# EAGLE design Gen4Board (EAGLE 9.4.2)
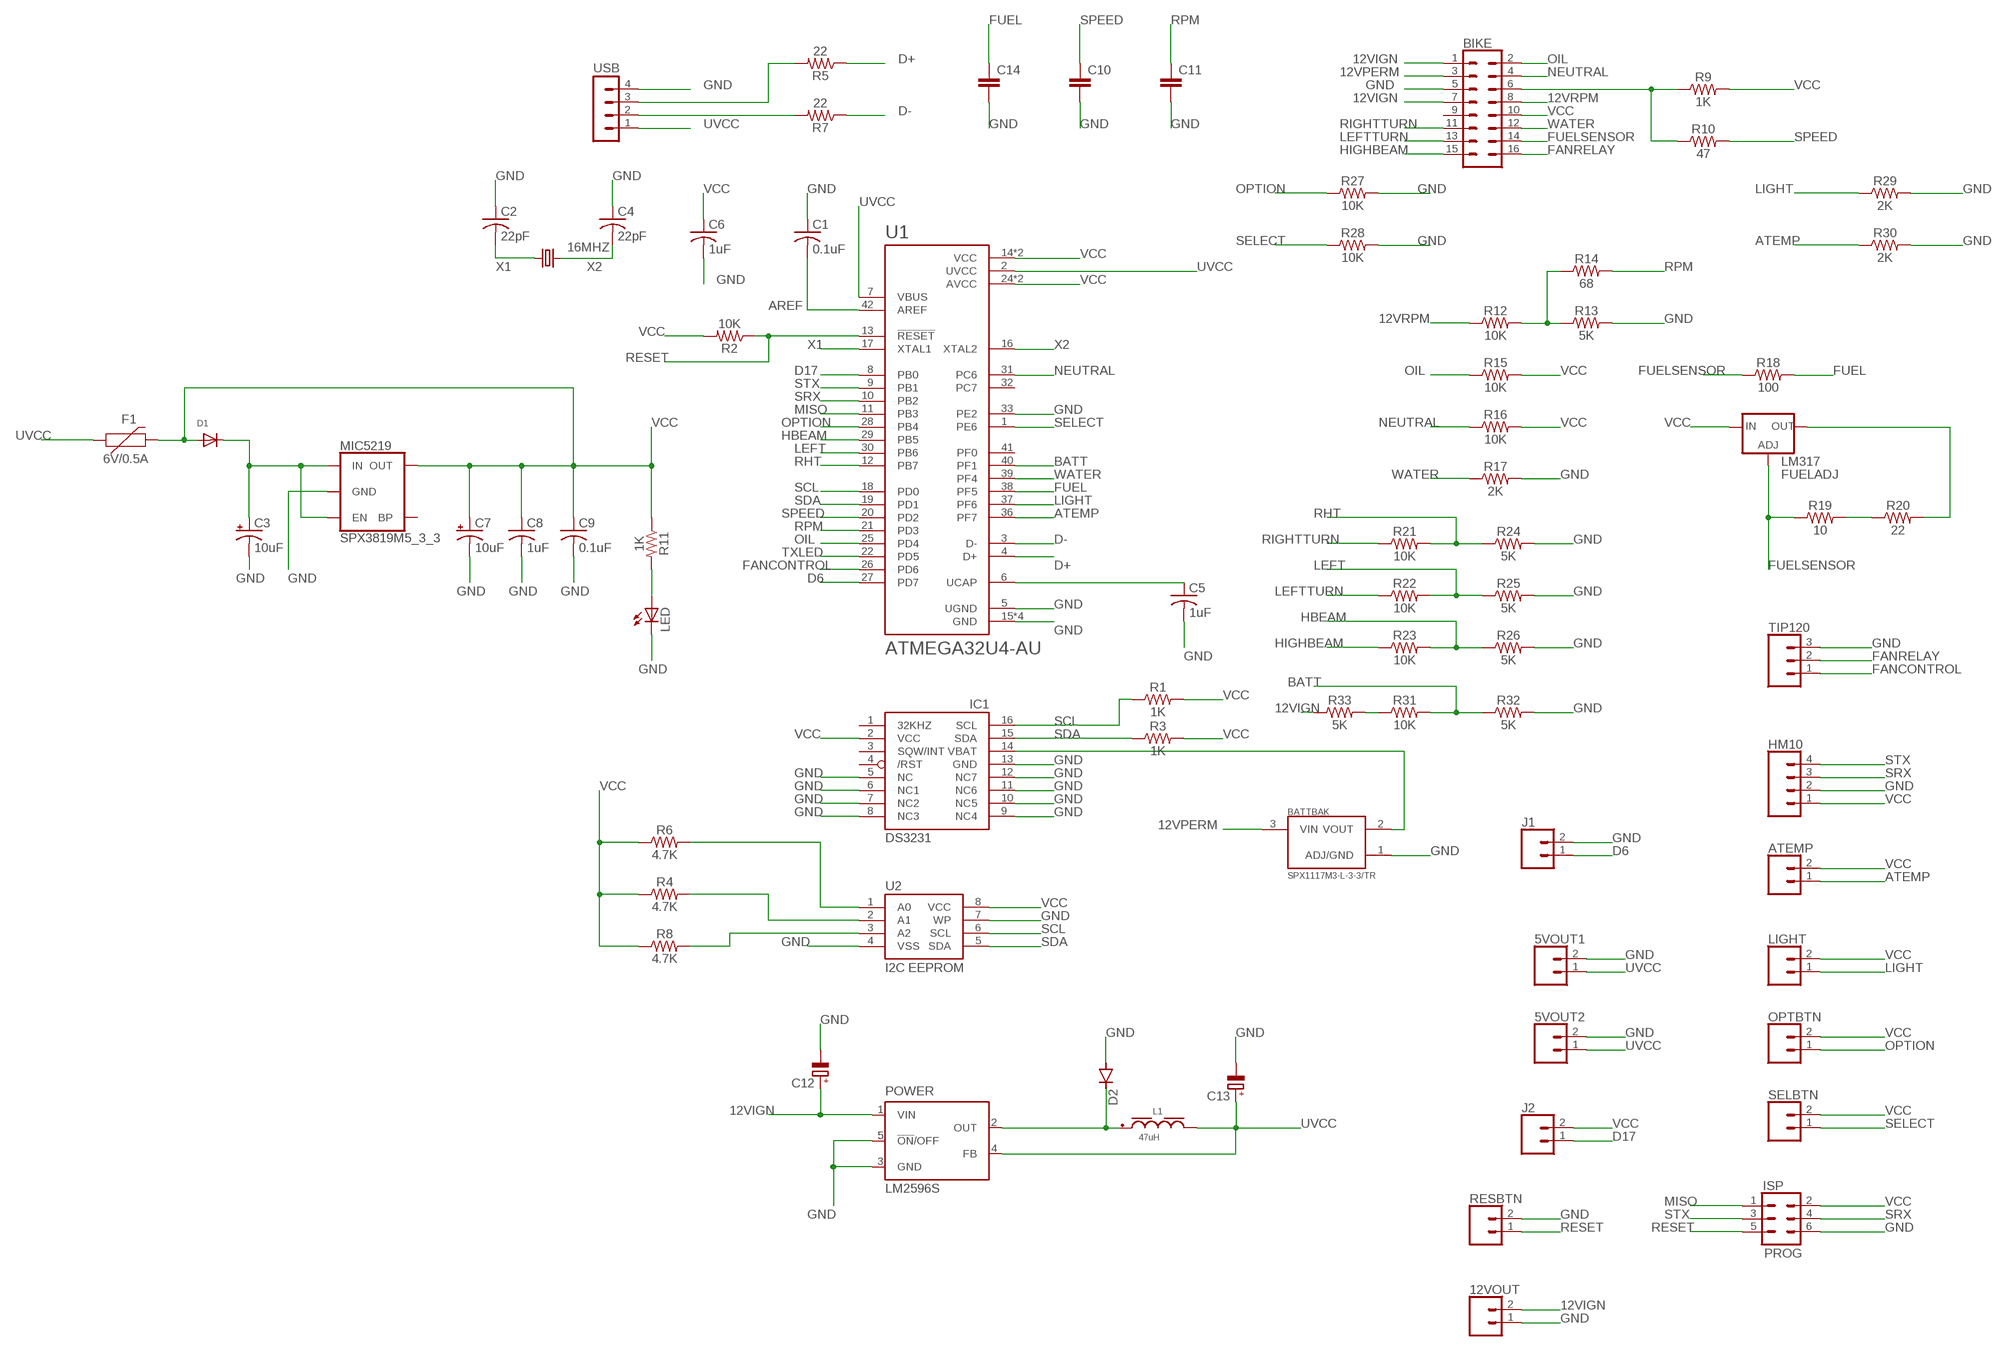
[diagram p0: schematic, sheet 1]

## Parts
5VOUT1  CONN_02  [1X02]
5VOUT2  CONN_02  [1X02]
12VOUT  CONN_02  [1X02]
16MHZ  KX-9A  [5.0X3.2_KX-9A]
ATEMP  CONN_02  [1X02]
BATTBAK  SPX1117M3-L-3-3/TR  [SOT230P700X180-3N]
BIKE  CONN_08X2  [2X8]
C1  0.1uF  C-USC0603  [C0603]
C2  22pF  C-USC0603  [C0603]
C3  10uF  10UF-POLAR-EIA3216-16V-10%(TANT)  [EIA3216]
C4  22pF  C-USC0603  [C0603]
C5  1uF  C-USC0603  [C0603]
C6  1uF  C-USC0603  [C0603]
C7  10uF  10UF-POLAR-EIA3216-16V-10%(TANT)  [EIA3216]
C8  1uF  C-USC0603  [C0603]
C9  0.1uF  C-USC0603  [C0603]
C10  C2,5-3  [C2.5-3]
C11  C2,5-3  [C2.5-3]
C12  CPOL-EUTT5D10  [TT5D10]
C13  CPOL-EUTT5D10  [TT5D10]
C14  C2,5-3  [C2.5-3]
D1  DIODESOD-323F  [SOD-323F]
D2  DIODE-DO214AC  [DO214AC]
F1  6V/0.5A  PPTC_HALF-AMP  [1206]
HM10  CONN_04  [1X04]
IC1  DS3231/SO  [SO16W]
ISP  PROG  CONN_03X2FEMALE  [2X3]
J1  CONN_02  [1X02]
J2  CONN_02  [1X02]
L1  47uH  WE-PD_1260_74477126  [WE-PD_1260]
LED  LEDCHIPLED_0603  [CHIPLED_0603]
LIGHT  CONN_02  [1X02]
LM317  FUELADJ  V_REG_317SINK  [TO220-ADJ]
MIC5219  SPX3819M5_3_3  V_REG_SPX3819-SOT23-5  [SOT23-5]
OPTBTN  CONN_02  [1X02]
POWER  LM2596S  [TO263-5]
R1  1K  2.0KOHM-0603-1/10W-5%  [0603]
R2  10K  2.0KOHM-0603-1/10W-5%  [0603]
R3  1K  2.0KOHM-0603-1/10W-5%  [0603]
R4  4.7K  2.0KOHM-0603-1/10W-5%  [0603]
R5  22  2.0KOHM-0603-1/10W-5%  [0603]
R6  4.7K  2.0KOHM-0603-1/10W-5%  [0603]
R7  22  2.0KOHM-0603-1/10W-5%  [0603]
R8  4.7K  2.0KOHM-0603-1/10W-5%  [0603]
R9  1K  RESISTOR1206  [1206]
R10  47  RESISTOR1206  [1206]
R11  1K  2.0KOHM-0603-1/10W-5%  [0603]
R12  10K  RESISTOR1206  [1206]
R13  5K  RESISTOR1206  [1206]
R14  68  RESISTOR1206  [1206]
R15  10K  RESISTOR1206  [1206]
R16  10K  RESISTOR1206  [1206]
R17  2K  RESISTOR1206  [1206]
R18  100  RESISTOR1206  [1206]
R19  10  RESISTOR1206  [1206]
R20  22  RESISTOR1206  [1206]
R21  10K  RESISTOR1206  [1206]
R22  10K  RESISTOR1206  [1206]
R23  10K  RESISTOR1206  [1206]
R24  5K  RESISTOR1206  [1206]
R25  5K  RESISTOR1206  [1206]
R26  5K  RESISTOR1206  [1206]
R27  10K  RESISTOR1206  [1206]
R28  10K  RESISTOR1206  [1206]
R29  2K  RESISTOR1206  [1206]
R30  2K  RESISTOR1206  [1206]
R31  10K  RESISTOR1206  [1206]
R32  5K  RESISTOR1206  [1206]
R33  5K  RESISTOR1206  [1206]
RESBTN  CONN_02  [1X02]
SELBTN  CONN_02  [1X02]
TIP120  CONN_03  [1X03]
U1  ATMEGA32U4-AU  [QFP80P1200X1200X120-44N]
U2  I2C EEPROM  EEPROM-I2CEIAJ  [SO08-EIAJ]
USB  MA04-1  [MA04-1]

## Nets
12VIGN: 12VOUT.2 BIKE.1 BIKE.7 C12.+ POWER.1(VIN) R33.1
12VPERM: BATTBAK.3(VIN) BIKE.3
12VRPM: BIKE.8 R12.1
AREF: C1.2 U1.42(AREF)
ATEMP: ATEMP.1 R30.1 U1.36(PF7)
BATT: R31.2 R32.1 U1.40(PF1)
D6: J1.1 U1.27(PD7)
D17: J2.1 U1.8(PB0)
D+: R5.1 U1.4(D+)
D-: R7.1 U1.3(D-)
FANCONTROL: TIP120.1 U1.26(PD6)
FANRELAY: BIKE.16 TIP120.2
FUEL: C14.1 R18.2 U1.38(PF5)
FUELSENSOR: BIKE.14 LM317.ADJ R18.1 R19.1
GND: 5VOUT1.2 5VOUT2.2 12VOUT.1 BATTBAK.1(ADJ/GND) BIKE.5 C1.1 C2.1 C3.- C4.1 C5.2 C6.2 C7.- C8.2 C9.2 C10.2 C11.2 C12.- C13.- C14.2 D2.A HM10.2 IC1.5(NC) IC1.6(NC1) IC1.7(NC2) IC1.8(NC3) IC1.9(NC4) IC1.10(NC5) IC1.11(NC6) IC1.12(NC7) IC1.13(GND) ISP.6 J1.2 LED.C MIC5219.2(GND) POWER.3(GND) POWER.5(!ON!/OFF) R13.2 R17.2 R24.2 R25.2 R26.2 R27.2 R28.2 R29.2 R30.2 R32.2 RESBTN.2 TIP120.3 U1.5(UGND) U1.15(GND) U1.23(GND) U1.33(PE2) U1.35(GND) U1.43(GND) U2.4(VSS) U2.7(WP) USB.4
HBEAM: R23.2 R26.1 U1.29(PB5)
HIGHBEAM: BIKE.15 R23.1
LEFT: R22.2 R25.1 U1.30(PB6)
LEFTTURN: BIKE.13 R22.1
LIGHT: LIGHT.1 R29.1 U1.37(PF6)
MISO: ISP.1 U1.11(PB3)
N$2: R7.2 USB.2
N$3: R5.2 USB.3
N$4: C5.1 U1.6(UCAP)
N$5: LED.A R11.2
N$6: C3.+ D1.C MIC5219.1(IN) MIC5219.3(EN)
N$7: R6.2 U2.1(A0)
N$8: R4.2 U2.2(A1)
N$9: BATTBAK.2(VOUT) IC1.14(VBAT)
N$10: R8.2 U2.3(A2)
N$11: BIKE.6 R9.1 R10.1
N$12: LM317.OUT R20.2
N$13: R12.2 R13.1 R14.1
N$14: D2.C L1.1 POWER.2(OUT)
N$15: R19.2 R20.1
N$16: R31.1 R33.2
NEUTRAL: BIKE.4 R16.1 U1.31(PC6)
OIL: BIKE.2 R15.1 U1.25(PD4)
OPTION: OPTBTN.1 R27.1 U1.28(PB4)
RESET: ISP.5 R2.1 RESBTN.1 U1.13(!RESET)
RHT: R21.2 R24.1 U1.12(PB7)
RIGHTTURN: BIKE.11 R21.1
RPM: C11.1 R14.2 U1.21(PD3)
SCL: IC1.16(SCL) R1.1 U1.18(PD0) U2.6(SCL)
SDA: IC1.15(SDA) R3.1 U1.19(PD1) U2.5(SDA)
SELECT: R28.1 SELBTN.1 U1.1(PE6)
SPEED: C10.1 R10.2 U1.20(PD2)
SRX: HM10.3 ISP.4 U1.10(PB2)
STX: HM10.4 ISP.3 U1.9(PB1)
TXLED: U1.22(PD5)
UVCC: 5VOUT1.1 5VOUT2.1 C13.+ F1.1 L1.2 POWER.4(FB) U1.2(UVCC) U1.7(VBUS) USB.1
VCC: ATEMP.2 BIKE.10 C6.1 C7.+ C8.1 C9.1 D1.A F1.2 HM10.1 IC1.2(VCC) ISP.2 J2.2 LIGHT.2 LM317.IN MIC5219.5(OUT) OPTBTN.2 R1.2 R2.2 R3.2 R4.1 R6.1 R8.1 R9.2 R11.1 R15.2 R16.2 SELBTN.2 U1.14(VCC) U1.24(AVCC) U1.34(VCC) U1.44(AVCC) U2.8(VCC)
WATER: BIKE.12 R17.1 U1.39(PF4)
X1: 16MHZ.1 C2.2 U1.17(XTAL1)
X2: 16MHZ.3 C4.2 U1.16(XTAL2)
Unconnected: BIKE.9 IC1.1(32KHZ) IC1.3(SQW/INT) IC1.4(/RST) MIC5219.4(BP) U1.32(PC7) U1.41(PF0)

## Library data of the parts
5VOUT1 5VOUT2 12VOUT ATEMP J1 J2 LIGHT OPTBTN RESBTN SELBTN = SparkFun-Connectors:CONN_02: Multi connection point. Often used as Generic Header-pin footprint for 0.1 inch spaced/style header connections On any of the 0.1 inch spaced packages, you can populate with these: Break Away Headers - Straight <https://www.sparkfun.com/products/116> (PRT-00116) Break Away Male Headers - Right Angle <https://www.sparkfun.com/products/553> (PRT-00553) Female Headers <https://www.sparkfun.com/products/115> (PRT-00115) Break Away Headers - Machine Pin <https://www.sparkfun.com/products/117> (PRT-00117) Break Away Female Headers - Swiss Machine Pin <https://www.sparkfun.com/products/743> (PRT-00743) For SCREWTERMINALS and SPRING TERMINALS visit here: Screw Terimnals on SparkFun.com <https://www.sparkfun.com/search/results?term=Screw+Terminals> (5mm/3.5mm/2.54mm spacing) This device is also useful as a general connection point to wire up your design to another part of your project. Our various solder wires solder well into these plated through hole pads. Hook-Up Wire - Assortment (Stranded, 22 AWG) <https://www.sparkfun.com/products/11375> (PRT-11375) Hook-Up Wire - Assortment (Solid Core, 22 AWG) <https://www.sparkfun.com/products/11367> (PRT-11367) View the entire wire category on our website here <https://www.sparkfun.com/categories/141> Special notes: Molex polarized connector foot print use with: PRT-08233 with associated crimp pins and housings. 2.54_SCREWTERM for use with PRT-10571. 3.5mm Screw Terminal footprints for PRT-08084 5mm Screw Terminal footprints for use with PRT-08432
16MHZ = crystal-geyer_V1_0:KX: Quartz Crystals (MHz) SMD: KX - Serie Model Size l/w/h [mm] Frequency Range Frequency Stability Temp. Range [°C] Load Capacitance AECQ 200 availabel Datasheet KX-4 KX-5 KX-6 KX-7 KX-9A KX-9B KX-12A KX-12B KX-13 KX-20 KX-K KX-KS 1.6/1.2/0.3 2.0/1.6/0.45 2.5/2.0/0.55 3.2/2.5/0.8 5.0/3.2/1.0 5.0/3.2/1.1 6.0/3.5/1.1 6.0/3.5/1.0 7.0/5.0 /1.3 11.6/5.5/1.6 12.3/4.5/4.2 12.3/4.5/3.2 24.0 ~ 80.0 MHz 16.0 ~ 80.0 MHz 12.0 ~ 80.0 MHz 8.0 ~ 60.0 MHz 7,68 ~ 300,0 MHz 8,0 ~ 50,0 MHz 8,0 ~ 150,0 MHz 8,0 ~ 50,0 MHz 6,0 ~ 160,0 MHz 3,579 ~ 25,0 MHz 3,579 ~ 70,0 MHz 3,579 ~ 70,0 MHz ±10 … ±50ppm ±10 … ±50ppm ±10 … ±50ppm ±10 … ±50ppm ±10 … ±50ppm ±10 … ±50ppm ±10 … ±50ppm ±10 … ±50ppm ±10 … ±50ppm ±50ppm ±10 … ±50ppm ±10 … ±50ppm (*) -40°C …+85°C (*) -40°C …+125°C (*) -40°C …+125°C (*) -40°C …+125°C (*) -40°C …+105°C (*) -40°C …+105°C (*) -40°C …+125°C (*) -40°C …+105°C (*) -40°C …+105°C (*) -40°C …+105°C (*) -40°C …+85°C (*) -40°C …+85°C 8, 8…16 8, 8…16 10, 8…16 12, 7…20 16, 10…20 16, 10…20 16, 10…20 16, 12…20 16, 12…20 16, 12…20 16, 12…30 16, 12…30 - yes yes yes - - - - - - - - KX-4.pdf <http://www.geyer-electronic.de/uploads/tx_userartikelfrequenz/GEYER-KX-4.pdf> KX-5.pdf <http://www.geyer-electronic.de/uploads/tx_userartikelfrequenz/GEYER-KX-5.pdf> KX-6.pdf <http://www.geyer-electronic.de/uploads/tx_userartikelfrequenz/GEYER-KX-6.pdf> KX-7.pdf <http://www.geyer-electronic.de/uploads/tx_userartikelfrequenz/GEYER-KX-7.pdf> KX-9A.pdf <http://www.geyer-electronic.de/uploads/tx_userartikelfrequenz/GEYER-KX-9A.pdf> KX-9B.pdf <http://www.geyer-electronic.de/uploads/tx_userartikelfrequenz/GEYER-KX-9B.pdf> KX-12A.pdf <http://www.geyer-electronic.de/uploads/tx_userartikelfrequenz/GEYER-KX-12A.pdf> KX-12B.pdf <http://www.geyer-electronic.de/uploads/tx_userartikelfrequenz/GEYER-KX-12B.pdf> KX-13.pdf <http://www.geyer-electronic.de/uploads/tx_userartikelfrequenz/GEYER-KX-13.pdf> KX-20.pdf <http://www.geyer-electronic.de/uploads/tx_userartikelfrequenz/GEYER-KX-20.pdf> KX-K.pdf <http://www.geyer-electronic.de/uploads/tx_userartikelfrequenz/GEYER-KX-K.pdf> KX-KS.pdf <http://www.geyer-electronic.de/uploads/tx_userartikelfrequenz/GEYER-KX-KS.pdf> <http://www.geyer-electronic.de/fileadmin/template/img/logo-geyer-electronic.png> Details see: http://www.geyer-electronic.de/Frequenz-Produkte.9.0.html Created 2016-06-07, Hans Locher 2016 (C) Geyer Quartz Technology KX4,KX5,KX6,KX7,KX9A,KX9B,KX12A,KX12B,KX13,KX20,KXK,KXKS;1612;2016;2520;3225;5032;6035;7050;11655;12345;1,6x1,2;2,0x1,6;2,5x2,0;3,2x2,5;5,0x3,2;6,0x3,5;7,0x5,0;11,6x5,5;12,3x4,5;12,3x4,5;1.6x1.2;2.0x1.6;2.5x2.0;3.2x2.5;5.0x3.2;6.0x3.5;7.0x5.0;11.6x5.5;12.3x4.5;12.3x4.5;
BATTBAK = SPX1117M3-L-3-3_TR:SPX1117M3-L-3-3/TR: Check prices <https://pricing.snapeda.com/parts/SPX1117M3-L-3-3/TR/MaxLinear%2C%20Inc./view-part?ref=eda>; AVAILABILITY: Good; DESCRIPTION: Linear Voltage Regulator IC Positive Fixed 1 Output 800mA SOT-223; MF: MaxLinear, Inc.; MP: SPX1117M3-L-3-3/TR; PACKAGE: SOT-223 MaxLinear, Inc.; PRICE: None; PURCHASE-URL: https://pricing.snapeda.com/search/part/SPX1117M3-L-3-3/TR/?ref=eda
BIKE = SparkFun-Connectors:CONN_08X2: Multi connection point. Often used as Generic Header-pin footprint for 0.1 inch spaced/style header connections You can populate with any combo of single row headers, but if you'd like an exact match, check this: Header - 2x8 (Male, 0.1") <https://www.sparkfun.com/products/13156> (PRT-13156) On any of the 0.1 inch spaced packages, you can populate with these: Break Away Headers - Straight <https://www.sparkfun.com/products/116> (PRT-00116) Break Away Male Headers - Right Angle <https://www.sparkfun.com/products/553> (PRT-00553) Female Headers <https://www.sparkfun.com/products/115> (PRT-00115) Break Away Headers - Machine Pin <https://www.sparkfun.com/products/117> (PRT-00117) Break Away Female Headers - Swiss Machine Pin <https://www.sparkfun.com/products/743> (PRT-00743)
C1 C2 C4-C6 C8 C9 = adafruit:C-US: CAPACITOR, American symbol
C3 C7 = SparkFun-Capacitors:10UF-POLAR: 10.0µF polarized capacitors A capacitor is a passive two-terminal electrical component used to store electrical energy temporarily in an electric field.; PROD_ID: CAP-00811
C10 C11 C14 = capacitor-wima:C: CAPACITOR naming: grid - package width
C12 C13 = rcl:CPOL-EU: POLARIZED CAPACITOR, European symbol; SPICEPREFIX: C
D1 = adafruit:DIODE: Diode SMADIODE - SMA Surface Mount Package 20V 1A Schottky Diode Digikey: 641-1014-6-ND DO-1N4148 - Through Hole Small Current Diode SOD-123 20V 1 A (.5mV Vf) Schottky Diode - Digikey: MBRX120TPMSCT-ND SOD-323 10V 570mA (.38mV Vf, 3ns) Schottky Diode - Digikey: ZLLS410CT-ND SOD-523 30V 30mA Schottky Diode (RB751S-40TE61) - Digikey: RB751S-40TE61CT-ND SOT23-R/W - SOT23 Package (R = Solder Paste/Reflow Ovens, W = Hand-Soldering) BAT54Film 40V 300mA - Digikey: 497-7162-1-ND
D2 = diode:DIODE-: DIODE
F1 = SparkFun-Fuses:PPTC: Resettable Fuse PPTC Resettable Fuse. Really a sort of resistor with a polymeric positive temperature coefficient whose resistance increases dramatically with an increase in temperature. When heated by the power passing through the resistance rises causing the current to be limited, protecting the circuit. This is achieved by the transition of the polymer from a crystalline to an amorphous state where the conductive carbon separates breaking the conductive pathways found in the cool crystalline structure. When a PPTC cools back down it resumes conducting letting the circuit turn back on. SparkFun Products: SparkFun RedBoard - Programmed with Arduino <https://www.sparkfun.com/products/12757> Pro Micro - 5V/16MHz <https://www.sparkfun.com/products/12640> Arduino Pro 328 - 5V/16MHz <https://www.sparkfun.com/products/10915> MP3 Trigger <https://www.sparkfun.com/products/13720>; PROD_ID: RES-08585
HM10 = SparkFun-Connectors:CONN_04: Multi connection point. Often used as Generic Header-pin footprint for 0.1 inch spaced/style header connections On any of the 0.1 inch spaced packages, you can populate with these: Break Away Headers - Straight <https://www.sparkfun.com/products/116> (PRT-00116) Break Away Male Headers - Right Angle <https://www.sparkfun.com/products/553> (PRT-00553) Female Headers <https://www.sparkfun.com/products/115> (PRT-00115) Break Away Headers - Machine Pin <https://www.sparkfun.com/products/117> (PRT-00117) Break Away Female Headers - Swiss Machine Pin <https://www.sparkfun.com/products/743> (PRT-00743) For SCREWTERMINALS and SPRING TERMINALS visit here: Screw Terimnals on SparkFun.com <https://www.sparkfun.com/search/results?term=Screw+Terminals> (5mm/3.5mm/2.54mm spacing) This device is also useful as a general connection point to wire up your design to another part of your project. Our various solder wires solder well into these plated through hole pads. Hook-Up Wire - Assortment (Stranded, 22 AWG) <https://www.sparkfun.com/products/11375> (PRT-11375) Hook-Up Wire - Assortment (Solid Core, 22 AWG) <https://www.sparkfun.com/products/11367> (PRT-11367) View the entire wire category on our website here <https://www.sparkfun.com/categories/141> Special notes: Molex polarized connector foot print use with SKU : PRT-08231 with associated crimp pins and housings. 1MM SMD Version SKU: PRT-10208; PROD_ID: CONN-09696
IC1 = DS3231:DS3231; AVAILABILITY: Unavailable; DESCRIPTION: Real Time Clock (RTC) IC Clock/Calendar I²C, 2-Wire Serial 16-SOIC (0.295, 7.50mm Width); MF: Maxim Integrated; MP: DS3231; PACKAGE: SOIC-16 Maxim Integrated; PRICE: None
ISP = SparkFun-Connectors:CONN_03X2: Multi connection point. Often used as Generic Header-pin footprint for 0.1 inch spaced/style header connections You can populate with any combo of single row headers, but if you'd like an exact match, check these: Header - 2x3 (Male, 0.1") <https://www.sparkfun.com/products/12807> (PRT-12807) Header - 2x3 (Female, 0.1") <https://www.sparkfun.com/products/13010> (PRT-13010) 2x3 Pin Shrouded Header <https://www.sparkfun.com/products/10877> (PRT-10877) On any of the 0.1 inch spaced packages, you can populate with these: Break Away Headers - Straight <https://www.sparkfun.com/products/116> (PRT-00116) Break Away Male Headers - Right Angle <https://www.sparkfun.com/products/553> (PRT-00553) Female Headers <https://www.sparkfun.com/products/115> (PRT-00115) Break Away Headers - Machine Pin <https://www.sparkfun.com/products/117> (PRT-00117) Break Away Female Headers - Swiss Machine Pin <https://www.sparkfun.com/products/743> (PRT-00743) Special note: the shrouded connector mates well with our 3x2 ribbon cables: Ribbon Crimp Connector - 6-pin (2x3, Female) <https://www.sparkfun.com/products/10651> (PRT-10651) Ribbon Cable - 6 wire (15ft) <https://www.sparkfun.com/products/10646> (PRT-10646); PROD_ID: CONN-11566; VALUE: FEMALE 2x3
L1 = Wurth_Power Magnetics_WE-PD:WE-PD_1260: WE-PD SMT Power Inductor Characteristics AECQ 200 Qualified Ultra low RDC and RAC Highest possible saturation current based on Ferrite Suitable for switching frequency up to 10MHz Temperature dependent parameter available on Redexpert Operating Temperature from -40°C to +125°C / +150°C Types WE-PD: Since always with low loss material, tight tolerances and high saturation behavior compared to other manufacturers in the market WE-PD Robust: Plastic base improves the mechanical stability and efficiency WE-PD Performance: MnZn core improves Saturation and RDC for highest efficiency Applications Switch Mode Power supplies from 0,1W up to 300W Integrated DC DC Converter Ideal for Switch Mode Power supplies with extreme high efficiency (>95%) <https://www.we-online.com/catalog/media/o14825v209%20Family_WE-PD.jpg> Details see: https://www.we-online.com/catalog/en/WE-PD/ Updated by Yingchun,Shan 2019-07-25 2019 (C) Wurth Elektronik; DATASHEET-URL: https://www.we-online.com/catalog/datasheet/74477126.pdf; FRES: 2.3MHz; IR: 0.55A; ISAT: 0.68A; MOUNT: SMT; PART-NUMBER: 74477126; RDC-MAX: 1200mOhm; RDC-TYP: 880mOhm; VALUE: 680uH; VERSION: Standard
LED = adafruit:LED: LED OSRAM: - CHIPLED LG R971, LG N971, LY N971, LG Q971, LY Q971, LO R971, LY R971 LH N974, LH R974 LS Q976, LO Q976, LY Q976 LO Q996 - Hyper CHIPLED LW Q18S LB Q993, LB Q99A, LB R99A - SideLED LS A670, LO A670, LY A670, LG A670, LP A670 LB A673, LV A673, LT A673, LW A673 LH A674 LY A675 LS A676, LA A676, LO A676, LY A676, LW A676 LS A679, LY A679, LG A679 - Hyper Micro SIDELED® LS Y876, LA Y876, LO Y876, LY Y876 LT Y87S - SmartLED LW L88C, LW L88S LB L89C, LB L89S, LG L890 LS L89K, LO L89K, LY L89K LS L896, LA L896, LO L896, LY L896 - TOPLED LS T670, LO T670, LY T670, LG T670, LP T670 LSG T670, LSP T670, LSY T670, LOP T670, LYG T670 LG T671, LOG T671, LSG T671 LB T673, LV T673, LT T673, LW T673 LH T674 LS T676, LA T676, LO T676, LY T676, LB T676, LH T676, LSB T676, LW T676 LB T67C, LV T67C, LT T67C, LS T67K, LO T67K, LY T67K, LW E67C LS E67B, LA E67B, LO E67B, LY E67B, LB E67C, LV E67C, LT E67C LW T67C LS T679, LY T679, LG T679 LS T770, LO T770, LY T770, LG T770, LP T770 LB T773, LV T773, LT T773, LW T773 LH T774 LS E675, LA E675, LY E675, LS T675 LS T776, LA T776, LO T776, LY T776, LB T776 LHGB T686 LT T68C, LB T68C - Hyper Mini TOPLED® LB M676 - Mini TOPLED Santana® LG M470 LS M47K, LO M47K, LY M47K Source: http://www.osram.convergy.de/
LM317 = SparkFun-IC-Power:V_REG_317: Voltage Regulator Standard LM317 adjustable voltage regulator. AOI (Adjust Output Input). Google 'LM317 Calculator' for easy to use app to get the two resistor values needed. 240/720 for 5V output. 240/390 for 3.3V output. Spark Fun Electronics SKU : COM-00527
MIC5219 = SparkFun-IC-Power:V_REG_SPX3819: SPX3819 Voltage Regulator 3.3V 500mA, 16V input Datasheet <https://www.exar.com/content/document.ashx?id=22106> SparkFun Products: SparkFun Serial Controlled Motor Driver <https://www.sparkfun.com/products/13911>; PROD_ID: VREG-13321
POWER = national-semiconductor:LM2596: SIMPLE SWITCHER® Power Converter 150 kHz 3A Step-Down Voltage Regulator Source: http://www.national.com/ds/LM/LM2596.pdf; MF: NATIONAL SEMICONDUCTOR; MPN: LM2596S-ADJ/NOPB; OC_FARNELL: 9494367; OC_NEWARK: 41K3842
R1-R8 R11 = SparkFun-Resistors:2.0KOHM: 2kΩ resistor A resistor is a passive two-terminal electrical component that implements electrical resistance as a circuit element. Resistors act to reduce current flow, and, at the same time, act to lower voltage levels within circuits. - Wikipedia; PROD_ID: RES-08296; VALUE: 2.0k
R9 R10 R12-R33 = SparkFun-Resistors:RESISTOR: Generic Resistor Package
TIP120 = SparkFun-Connectors:CONN_03: Multi connection point. Often used as Generic Header-pin footprint for 0.1 inch spaced/style header connections On any of the 0.1 inch spaced packages, you can populate with these: Break Away Headers - Straight <https://www.sparkfun.com/products/116> (PRT-00116) Break Away Male Headers - Right Angle <https://www.sparkfun.com/products/553> (PRT-00553) Female Headers <https://www.sparkfun.com/products/115> (PRT-00115) Break Away Headers - Machine Pin <https://www.sparkfun.com/products/117> (PRT-00117) Break Away Female Headers - Swiss Machine Pin <https://www.sparkfun.com/products/743> (PRT-00743) Stackable Header - 3 Pin (Female, 0.1") <https://www.sparkfun.com/products/13875> (PRT-13875) For SCREWTERMINALS and SPRING TERMINALS visit here: Screw Terimnals on SparkFun.com <https://www.sparkfun.com/search/results?term=Screw+Terminals> (5mm/3.5mm/2.54mm spacing) This device is also useful as a general connection point to wire up your design to another part of your project. Our various solder wires solder well into these plated through hole pads. Hook-Up Wire - Assortment (Stranded, 22 AWG) <https://www.sparkfun.com/products/11375> (PRT-11375) Hook-Up Wire - Assortment (Solid Core, 22 AWG) <https://www.sparkfun.com/products/11367> (PRT-11367) View the entire wire category on our website here <https://www.sparkfun.com/categories/141> Special notes: Molex polarized connector foot print use with SKU : PRT-08232 with associated crimp pins and housings.
U1 = ATMEGA32U4-AU:ATMEGA32U4-AU: ATmega Series 16 MHz 32 KB Flash 2.5 KB SRAM 8-Bit Microcontroller - TQFP-44 Check prices <https://pricing.snapeda.com/parts/ATMEGA32U4-AU/Microchip%20Technology/view-part?ref=eda>; AVAILABILITY: Warning; DESCRIPTION: AVR AVR® ATmega Microcontroller IC 8-Bit 16MHz 32KB (16K x 16) FLASH 44-TQFP (10x10); MF: Microchip Technology; MP: ATMEGA32U4-AU; PACKAGE: TQFP-44 Microchip Technology / Atmel; PRICE: None; PURCHASE-URL: https://pricing.snapeda.com/search/part/ATMEGA32U4-AU/?ref=eda
U2 = SparkFun-IC-Memory:EEPROM-I2C: I2C EEPROMs, 24LC256 and others 24LC256 Series 256 kb I2C 2 Wire (32 k x 8 Bit) 2.5 V Serial EEPROM SMD - SOIC-8 Datasheet SparkFun Products SparkFun UDB5 - PIC UAV Development Board <https://www.sparkfun.com/products/11703> (GPS-11703); PROD_ID: NA-XXXXX
USB = con-lstb:MA04-1: PIN HEADER; OC_FARNELL: unknown; OC_NEWARK: unknown

## Board
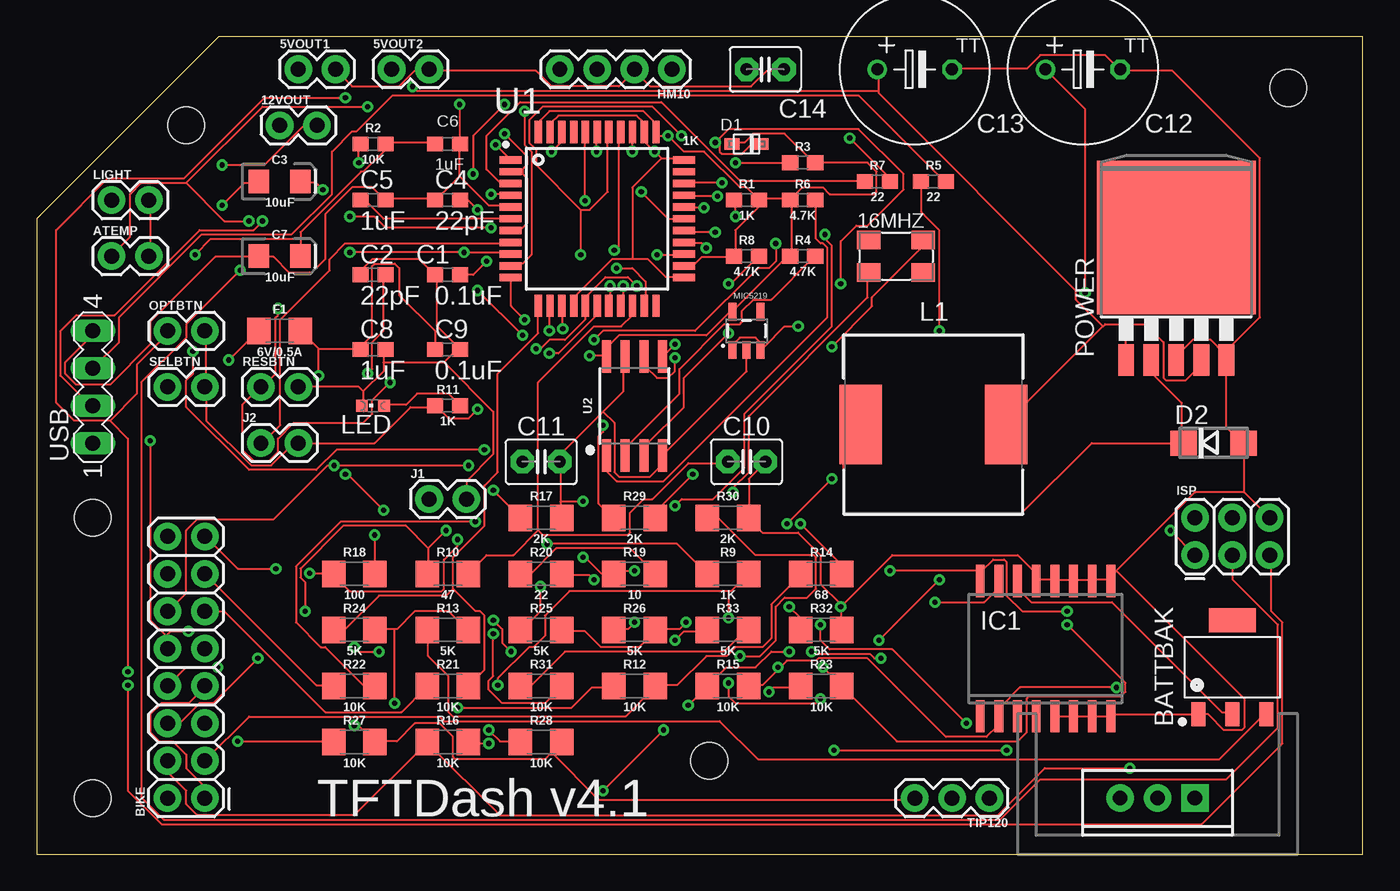
[diagram p1: board, top side]
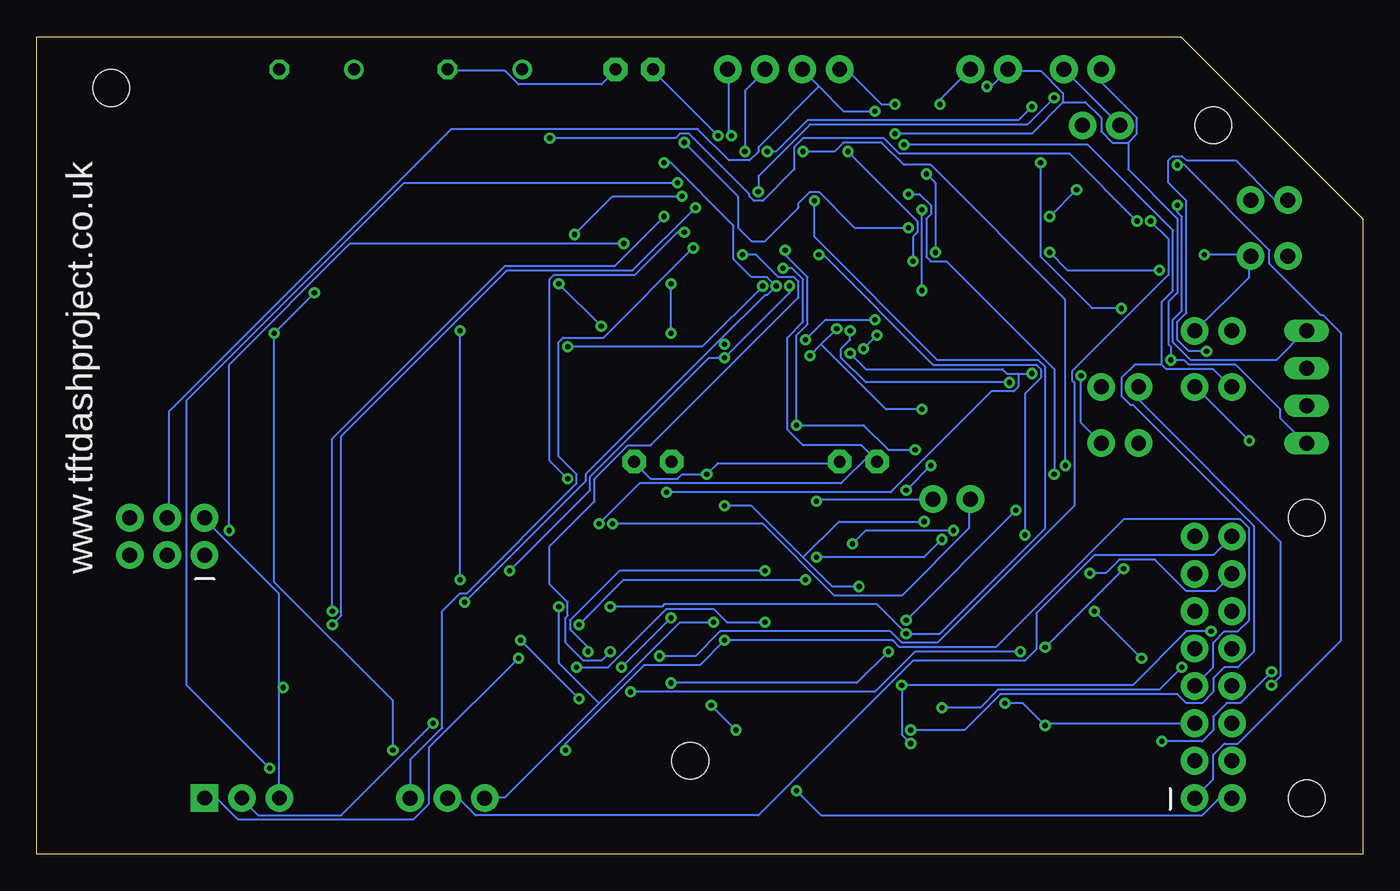
[diagram p2: board, bottom side, seen from below]

Size 90.15 x 55.55 mm. Coordinates in mm from the lower left corner, seen from the top.
Outline: 0,0 90.15,0 90.15,55.55 12.37,55.55 0,43.18 0,0
Copper layers (1*16): Top 0.035mm / dielectric 1.5mm / Bottom 0.035mm
Design rules "default": minimum track width 6mil, minimum drill 0.35mm, track to track 6mil, track to pad 6mil, pad to pad 6mil, via to via 6mil, smd to smd 6mil, copper to edge 40mil, drill to drill 6mil, minimum pad ring 10mil, minimum via ring 8mil, stop-mask expansion 4mil, vias tented up to drill 0mil, thermal gap 10mil
Holes 2.49 mm at 10.16,49.53 85.09,52.07 3.81,3.81 3.81,22.86 45.72,6.35

### Footprints (pad centres in the part's own frame; a part is rotated, then mirrored left to right if it is on the bottom)
1X02 = drill 1.016 pad 1.88: 1 0,0; 2 2.54,0
5.0X3.2_KX-9A = smd 1.6 x 1.25: 1 -1.85,-1.1; 2 1.85,-1.1; 3 1.85,1.1; 4 -1.85,1.1
SOT230P700X180-3N = smd 1.65 x 0.95: 1 -3.2,2.3; 2 -3.2,0; 3 -3.2,-2.3 | smd 1.65 x 3.2: 4 3.2,0
2X8 = drill 1.016 pad 1.88: 1 0,0; 2 0,2.54; 3 2.54,0; 4 2.54,2.54; 5 5.08,0; 6 5.08,2.54; 7 7.62,0; 8 7.62,2.54; 9 10.16,0; 10 10.16,2.54; 11 12.7,0; 12 12.7,2.54; 13 15.24,0; 14 15.24,2.54; 15 17.78,0; 16 17.78,2.54
C0603 = smd 1.1 x 1: 1 -0.85,0; 2 0.85,0
EIA3216 = smd 1.4 x 1.6: + 1.4,0; - -1.4,0
C2.5-3 = drill 0.813 pad 1.6 octagon: 1 -1.27,0; 2 1.27,0
TT5D10 = drill 0.813: + -2.54,0 | drill 0.813 octagon: - 2.54,0
SOD-323F = smd 1 x 0.8: A -1,0; C 1,0
DO214AC = smd 1.8 x 1.7: A 2.05,0; C -2.05,0
1206 = smd 1.6 x 1.8: 1 -1.4,0; 2 1.4,0
1X04 = drill 1.016 pad 1.88: 1 0,0; 2 2.54,0; 3 5.08,0; 4 7.62,0
SO16W = smd 0.6 x 2.2: 1 -4.445,-4.6; 2 -3.175,-4.6; 3 -1.905,-4.6; 4 -0.635,-4.6; 5 0.635,-4.6; 6 1.905,-4.6; 7 3.175,-4.6; 8 4.445,-4.6; 9 4.445,4.6; 10 3.175,4.6; 11 1.905,4.6; 12 0.635,4.6; 13 -0.635,4.6; 14 -1.905,4.6; 15 -3.175,4.6; 16 -4.445,4.6
2X3 = drill 1.016 pad 1.88: 1 0,0; 2 0,2.54; 3 2.54,0; 4 2.54,2.54; 5 5.08,0; 6 5.08,2.54
WE-PD_1260 = smd 2.9 x 5.4: 1 -4.95,0; 2 4.95,0
CHIPLED_0603 = smd 0.8 x 0.8: A 0,-0.75; C 0,0.75
TO220-ADJ = drill 1 pad 1.88 square: ADJ -2.54,0 | drill 1 pad 1.88: IN 2.54,0; OUT 0,0
SOT23-5 = smd 0.55 x 1.2: 1 -0.95,-1.3; 2 0,-1.3; 3 0.95,-1.3; 4 0.95,1.3; 5 -0.95,1.3
TO263-5 = smd 1.067 x 2.159: 1 -3.404,-5.791; 2 -1.702,-5.791; 3 0,-5.791; 4 1.702,-5.791; 5 3.404,-5.791 | smd 10.8 x 10.41: 6 0,2.54
0603 = smd 1.1 x 1: 1 -0.85,0; 2 0.85,0
1X03 = drill 1.016 pad 1.88: 1 0,0; 2 2.54,0; 3 5.08,0
QFP80P1200X1200X120-44N = smd 1.5 x 0.5: 1 -5.9,4; 2 -5.9,3.2; 3 -5.9,2.4; 4 -5.9,1.6; 5 -5.9,0.8; 6 -5.9,0; 7 -5.9,-0.8; 8 -5.9,-1.6; 9 -5.9,-2.4; 10 -5.9,-3.2; 11 -5.9,-4; 23 5.9,-4; 24 5.9,-3.2; 25 5.9,-2.4; 26 5.9,-1.6; 27 5.9,-0.8; 28 5.9,0; 29 5.9,0.8; 30 5.9,1.6; 31 5.9,2.4; 32 5.9,3.2; 33 5.9,4 | smd 0.5 x 1.5: 12 -4,-5.9; 13 -3.2,-5.9; 14 -2.4,-5.9; 15 -1.6,-5.9; 16 -0.8,-5.9; 17 0,-5.9; 18 0.8,-5.9; 19 1.6,-5.9; 20 2.4,-5.9; 21 3.2,-5.9; 22 4,-5.9; 34 4,5.9; 35 3.2,5.9; 36 2.4,5.9; 37 1.6,5.9; 38 0.8,5.9; 39 0,5.9; 40 -0.8,5.9; 41 -1.6,5.9; 42 -2.4,5.9; 43 -3.2,5.9; 44 -4,5.9
SO08-EIAJ = smd 0.61 x 2.21: 1 -1.905,-3.378; 2 -0.635,-3.378; 3 0.635,-3.378; 4 1.905,-3.378; 5 1.905,3.353; 6 0.635,3.353; 7 -0.635,3.353; 8 -1.905,3.353
MA04-1 = drill 1.016 long: 1 -3.81,0; 2 -1.27,0; 3 1.27,0; 4 3.81,0

### Placement (x,y rotation side)
5VOUT1  17.78,53.34 0 top
5VOUT2  24.13,53.34 0 top
12VOUT  16.51,49.53 0 top
16MHZ  58.42,40.64 0 top
ATEMP  5.08,40.64 0 top
BATTBAK  81.28,12.7 90 top
BIKE  11.43,3.81 90 top
C1  27.94,39.37 0 top
C2  22.86,39.37 0 top
C3  16.51,45.72 0 top
C4  27.94,44.45 0 top
C5  22.86,44.45 0 top
C6  27.94,48.26 0 top
C7  16.51,40.64 0 top
C8  22.86,34.29 0 top
C9  27.94,34.29 0 top
C10  48.26,26.67 0 top
C11  34.29,26.67 0 top
C12  71.12,53.34 0 top
C13  59.69,53.34 0 top
C14  49.53,53.34 0 top
D1  48.26,48.26 0 top
D2  80.01,27.94 0 top
F1  16.51,35.56 0 top
HM10  43.18,53.34 180 top
IC1  68.58,13.97 0 top
ISP  78.74,20.32 0 top
J1  26.67,24.13 0 top
J2  15.24,27.94 0 top
L1  60.96,29.21 0 top
LED  22.86,30.48 90 top
LIGHT  5.08,44.45 0 top
LM317  76.2,3.81 180 top
MIC5219  48.26,35.56 0 top
OPTBTN  8.89,35.56 0 top
POWER  77.47,39.37 0 top
R1  48.26,44.45 0 top
R2  22.86,48.26 0 top
R3  52.07,46.99 0 top
R4  52.07,40.64 0 top
R5  60.96,45.72 0 top
R6  52.07,44.45 0 top
R7  57.15,45.72 0 top
R8  48.26,40.64 0 top
R9  46.99,19.05 0 top
R10  27.94,19.05 0 top
R11  27.94,30.48 0 top
R12  40.64,11.43 0 top
R13  27.94,15.24 0 top
R14  53.34,19.05 0 top
R15  46.99,11.43 0 top
R16  27.94,7.62 0 top
R17  34.29,22.86 0 top
R18  21.59,19.05 0 top
R19  40.64,19.05 0 top
R20  34.29,19.05 0 top
R21  27.94,11.43 0 top
R22  21.59,11.43 0 top
R23  53.34,11.43 0 top
R24  21.59,15.24 0 top
R25  34.29,15.24 0 top
R26  40.64,15.24 0 top
R27  21.59,7.62 0 top
R28  34.29,7.62 0 top
R29  40.64,22.86 0 top
R30  46.99,22.86 0 top
R31  34.29,11.43 0 top
R32  53.34,15.24 0 top
R33  46.99,15.24 0 top
RESBTN  15.24,31.75 0 top
SELBTN  8.89,31.75 0 top
TIP120  64.77,3.81 180 top
U1  38.1,43.18 0 top
U2  40.64,30.48 0 top
USB  3.81,31.75 90 top

### Tracks (layer width: path | path; a pad name or v marks a point on that pad's centre or on a via)
12VIGN  (via drill 0.35)
  Top 0.152: v74.02,35.41 74.02,33.58 POWER.1 | v71.27,38.15 71.27,50.65 C12.+ | v43.38,14.53 43.99,15.14 45.52,15.14 R33.1 | BIKE.1 11.38,3.86 11.38,4.62 10.16,5.84 10.16,6.76 9.25,7.67 8.33,7.67 7.72,8.28 7.72,9.5 8.48,10.26 10.31,10.26 11.38,11.33 BIKE.7 | v12.6,46.84 15.49,46.84 18.09,49.43 19,49.43 12VOUT.2 | v54.2,7.06 v65.94,7.06
  Bottom 0.152: v71.27,38.15 v74.02,35.41 74.02,18.49 65.94,10.41 v65.94,7.06 | BIKE.7 10.16,12.7 10.16,14.38 9.4,15.14 8.48,15.14 7.72,15.9 7.72,22.15 8.33,22.76 16.26,22.76 24.94,14.07 31.5,14.07 31.95,14.53 v43.38,14.53 45.06,12.85 48.87,12.85 54.2,7.52 v54.2,7.06 | v12.6,46.84 12.14,46.84 6.35,41.05 6.35,40.13 2.84,36.63 2.69,36.63 1.47,35.41 1.47,14.53 8.48,7.52 9.4,7.52 10.16,6.76 10.16,5.08 BIKE.1
12VPERM
  Top 0.152: BIKE.3 14.43,9.35 27.38,9.35 27.69,9.04 46.43,9.04 49.02,6.45 80.42,6.45 83.46,9.5 BATTBAK.3
12VRPM  (via drill 0.35)
  Top 0.152: v28.6,9.96 36.37,9.96 37.74,11.33 39.12,11.33 R12.1 | v12.29,12.7 10.16,12.7 BIKE.8
  Bottom 0.152: v28.6,9.96 26.01,9.96 24.79,11.18 13.82,11.18 v12.29,12.7
AREF  (via drill 0.35)
  Top 0.152: C1.2 29.67,39.37 v30.58,40.28 | v35,47.75 35.61,48.36 35.61,48.97 U1.42
  Bottom 0.152: v30.58,40.28 30.58,41.96 30.28,42.27 30.28,43.03 v35,47.75
ATEMP  (via drill 0.35)
  Top 0.152: v40.49,47.75 40.49,48.97 U1.36 | v22.5,50.8 15.34,50.8 10.16,45.62 | 10.16,45.62 7.11,45.62 6.35,44.86 6.35,41.96 5.13,40.74 ATEMP.1 | v47.8,13.46 49.17,13.46 50.24,14.53 50.24,16.81 50.85,17.42 52.38,17.42 52.98,18.03 52.98,20.17 52.83,20.32 48.87,20.32 46.43,22.76 45.67,22.76 R30.1 | v14.43,43.03 12.75,43.03 10.16,45.62
  Bottom 0.152: v40.49,47.75 39.88,47.75 37.74,49.89 23.42,49.89 v22.5,50.8 | v47.8,13.46 45.36,13.46 43.69,15.14 32.11,15.14 31.34,14.38 28.91,14.38 19.61,23.67 19.61,32.05 19.76,32.21 19.76,32.82 13.21,39.37 13.21,41.81 v14.43,43.03
BATT  (via drill 0.35)
  Top 0.152: v37.29,44.4 37.29,48.97 U1.40 | v31.04,14.99 31.04,12.09 30.73,11.79 30.73,11.18 31.65,10.26 34.54,10.26 35.61,11.33 R31.2 | v51.16,16.81 51.92,16.05 51.92,15.29 R32.1
  Bottom 0.152: v37.29,44.4 37.29,41.96 28.91,33.58 22.05,33.58 21.59,33.12 21.59,22.15 28.75,14.99 v31.04,14.99 33.02,16.97 47.5,16.97 47.65,16.81 v51.16,16.81
D6  (via drill 0.35)
  Top 0.152: v46.13,42.27 44.15,42.27 U1.27 | v51,22.45 v54.05,25.5
  Bottom 0.152: v46.13,42.27 46.58,42.27 49.48,39.37 54.97,39.37 55.27,39.06 55.27,26.72 v54.05,25.5 | v51,22.45 40.79,22.45 35.92,17.58 31.34,17.58 26.77,22.15 26.77,24.13 J1.1
D17
  Top 0.152: U1.8 32.11,41.5 20.98,41.5 19.91,40.44 19.91,39.67 16.56,36.32 16.56,29.16 15.34,27.94 J2.1
D+  (via drill 0.35)
  Top 0.152: v61.37,35.56 61.37,42.42 60.15,43.64 60.15,45.62 R5.1 | v57.25,14.53 v61.37,18.64 | v53.29,10.57 52.98,10.26 47.5,10.26 47.04,10.72 v47.04,11.63 | v32.26,13.77 31.65,14.38 31.65,15.29 v31.04,15.9 | v23.57,23.37 21.13,25.81 v20.98,25.81 | v30.89,44.86 32.11,44.86 U1.4
  Bottom 0.152: v61.37,18.64 v61.37,35.56 | v53.29,10.57 v57.25,14.53 | v47.04,11.63 34.39,11.63 v32.26,13.77 | v23.57,23.37 v31.04,15.9 | v20.98,25.81 20.98,32.97 28.3,40.28 29.36,40.28 29.67,40.59 29.67,43.18 29.36,43.48 29.36,44.09 30.12,44.86 v30.89,44.86
D-
  Top 0.152: R7.1 56.19,45.77 47.8,45.77 42.47,51.11 32.87,51.11 30.58,48.82 30.58,46.53 31.5,45.62 32.11,45.62 U1.3
FANCONTROL  (via drill 0.35)
  Top 0.152: v45.52,41.2 45.21,41.5 44.15,41.5 U1.26
  Bottom 0.152: v45.52,41.2 51.61,35.1 54.36,35.1 54.66,34.8 54.66,27.03 53.44,25.81 53.44,25.2 60.91,17.73 61.37,17.73 62.59,16.51 62.59,8.58 64.72,6.45 64.72,3.86 TIP120.1
FANRELAY
  Bottom 0.152: BIKE.16 10.16,20.32 18.24,20.32 22.2,16.36 22.2,13.92 22.96,13.16 30.58,13.16 41.1,2.64 60.3,2.64 61.37,3.71 62.13,3.71 TIP120.2
FUEL  (via drill 0.35)
  Top 0.152: 36.98,43.79 37.59,43.79 38.81,45.01 38.81,48.97 U1.38 | 36.98,43.79 33.93,46.84 33.93,47.9 33.48,48.36 33.48,49.89 34.39,50.8 41.86,50.8 v43.84,48.82 | v22.96,21.69 22.96,19.1 R18.2 | 36.98,43.79 v36.98,40.74
  Bottom 0.152: v43.84,48.82 48.26,53.24 C14.1 | v22.96,21.69 22.96,31.29 21.9,32.36 21.9,32.97 22.2,33.27 29.21,33.27 36.68,40.74 v36.98,40.74
FUELSENSOR  (via drill 0.35)
  Top 0.152: v18.54,19.1 20.07,19.1 R18.1 20.22,18.95 21.29,17.88 27.53,17.88 27.69,18.03 27.69,20.02 28.6,20.93 v28.6,21.39 | v37.14,20.17 37.29,20.17 38.35,19.1 39.12,19.1 R19.1 39.27,19.1 39.42,19.25 v40.64,19.25 | v57.4,13.31 56.95,13.31 56.64,13.61 52.83,13.61 v52.68,13.77
  Bottom 0.152: v18.54,19.1 17.48,19.1 16.56,20.02 14.12,20.02 11.99,17.88 10.01,17.88 8.94,18.95 BIKE.14 | v37.14,20.17 29.82,20.17 v28.6,21.39 | v57.4,13.31 63.5,7.21 63.5,3.4 64.57,2.34 76.45,2.34 77.83,3.71 78.74,3.71 LM317.ADJ | v52.68,13.77 52.68,14.07 53.9,15.29 53.9,15.9 50.55,19.25 v40.64,19.25
GND  (via drill 0.35)
  Top 0.152: v12.6,44.09 14.12,45.62 15.04,45.62 C3.- | 28.75,46.08 28.75,48.21 C6.2 28.75,48.36 v28.75,50.95 | 28.75,46.08 27.23,44.55 C4.1 27.08,44.55 23.72,44.55 C5.2 23.57,44.55 22.81,45.31 21.44,45.31 19.61,43.48 19.61,40.44 18.69,39.52 17.17,39.52 16.1,40.59 15.19,40.59 C7.- 15.04,40.59 12.14,40.59 7.72,36.17 7.72,34.65 4.98,31.9 2.69,31.9 1.93,32.66 1.93,33.43 3.76,35.25 3.76,35.56 USB.4 | 28.75,46.08 30.73,44.09 32.11,44.09 U1.5 | 40.49,40.44 41.55,40.44 42.77,39.22 43.99,39.22 U1.23 | 40.49,40.44 39.12,40.44 36.53,37.85 36.53,37.39 U1.15 | U1.43 35,49.12 35,49.73 35.46,50.19 40.79,50.19 41.25,49.73 41.25,49.12 U1.35 41.4,48.97 41.4,48.36 v42.01,47.75 42.47,47.3 | 42.47,47.3 43.99,47.3 U1.33 | 40.49,40.44 40.49,45.31 42.47,47.3 | 5VOUT1.2 20.37,53.24 21.44,52.17 24.64,52.17 25.71,53.24 26.62,53.24 5VOUT2.2 26.77,53.24 33.93,53.24 35,52.17 39.57,52.17 40.64,53.24 | C13.- 62.28,53.39 67.31,53.39 68.22,54.3 72.64,54.3 73.56,53.39 C12.- 73.71,53.24 77.22,53.24 83.16,47.3 83.16,36.47 80.72,34.04 | 40.64,53.24 41.71,52.17 48.57,52.17 49.63,53.24 50.7,53.24 C14.2 | 40.64,53.24 HM10.2 | R25.2 35.76,15.14 37.29,15.14 38.35,14.07 40.95,14.07 42.01,15.14 R26.2 42.16,15.29 43.69,15.29 v44.15,15.75 | 24.33,15.29 24.49,15.29 25.71,16.51 27.99,16.51 29.21,15.29 R13.2 | 24.33,15.29 23.11,15.29 R24.2 | 35,6.91 35.61,7.52 R28.2 35,6.91 | 35,6.91 34.54,6.45 28.45,6.45 28.3,6.6 28.3,7.98 27.38,8.89 25.71,8.89 24.49,7.67 23.11,7.67 R27.2 22.96,7.67 21.9,8.74 v21.59,8.74 | 35,6.91 38.2,3.71 59.69,3.71 TIP120.3 | v24.33,10.26 24.33,15.29 | IC1.5 69.29,9.35 70.36,9.35 IC1.6 70.51,9.35 71.73,9.35 IC1.7 71.88,9.35 72.95,9.35 IC1.8 73.1,9.5 78.89,9.5 BATTBAK.1 79.05,9.5 79.65,9.5 80.72,8.43 81.94,8.43 82.09,8.58 82.09,10.57 73.41,19.25
  Top 0.152: 80.72,34.04 80.87,33.88 POWER.5 | 80.72,34.04 79.81,34.95 78.59,34.95 77.52,33.88 77.52,33.58 POWER.3 | 82.09,24.59 82.09,27.94 D2.A 81.94,27.94 80.87,29.01 POWER.5 | ISP.6 82.09,24.59 | 73.41,19.25 78.74,24.59 82.09,24.59 | 73.41,19.25 73.1,18.95 73.1,18.64 IC1.9 72.95,18.64 71.88,18.64 IC1.10 71.73,18.64 70.51,18.64 IC1.11 70.36,18.64 69.29,18.64 IC1.12 69.14,18.64 68.07,18.64 IC1.13 67.92,18.64 67.92,19.1 66.7,20.32 58.17,20.32 v54.66,16.81 | C2.1 22.05,39.37 22.05,39.67 22.81,40.44 26.01,40.44 27.08,39.37 C1.1 27.23,39.37 27.23,35.86 28.75,34.34 C9.2 28.75,34.19 28.45,34.19 27.69,33.43 | 22.2,31.44 22.2,30.53 LED.C | 22.2,31.44 23.57,32.82 23.57,33.43 | 23.57,33.43 23.57,34.19 C8.2 | 23.57,33.43 27.69,33.43 | RESBTN.2 21.9,31.75 22.2,31.44 | J1.2 29.21,25.35 31.04,27.18 31.04,30.07 27.69,33.43 | MIC5219.2 48.26,32.82 U2.4 42.47,27.03 42.47,26.42 41.71,25.65 39.57,25.65 39.27,25.96 39.27,29.31 38.51,30.07 | 35.61,23.98 35.61,26.57 C11.2 35.61,26.72 35.61,27.18 38.51,30.07 | 35.61,23.98 35.61,22.91 R17.2 | 38.51,30.07 39.88,31.44 39.88,33.73 U2.7 | v44.6,25.81 42.16,23.37 42.16,22.91 R29.2 | C10.2 49.48,26.57 48.41,25.5 48.41,22.91 R30.2 48.41,22.76 49.33,21.84 51.77,21.84 53.29,20.32 53.29,18.34 54.66,16.97 v54.66,16.81 | v54.66,16.81 54.66,15.29 R32.2 | 35.61,23.98 v37.14,23.98 | 80.72,34.04 POWER.5
  Bottom 0.152: v12.6,44.09 12.6,43.64 12.29,43.33 12.29,36.93 12.9,36.32 12.9,34.8 11.68,33.58 5.89,33.58 3.91,35.56 USB.4 | 5VOUT1.2 12VOUT.1 | C13.- 62.13,53.24 58.32,53.24 57.4,52.32 51.77,52.32 50.85,53.24 C14.2 | v42.01,47.75 42.01,51.87 40.64,53.24 HM10.2 | v28.75,50.95 28.75,51.26 5VOUT2.2 | BIKE.5 21.44,8.89 v21.59,8.74 23.11,10.26 v24.33,10.26 | v44.15,15.75 46.43,15.75 51.92,10.26 | 51.92,10.26 58.32,3.86 59.69,3.86 TIP120.3 | C10.2 49.48,26.57 48.41,25.5 46.58,25.5 46.28,25.81 v44.6,25.81 43.84,26.57 35.61,26.57 C11.2 | J1.2 36.98,24.13 v37.14,23.98 | 51.92,10.26 54.66,13 v54.66,16.81
HBEAM  (via drill 0.35)
  Top 0.152: v45.36,43.94 44.15,43.94 U1.29 | v70.05,15.6 74.02,11.63 74.02,11.02 73.71,10.72 67.46,10.72 67.31,10.57 67.31,8.28 66.7,7.67 58.47,7.67 54.81,11.33 R23.2 54.66,11.48 v53.44,12.7 | v40.64,15.75 40.18,15.29 39.27,15.29 R26.1
  Bottom 0.152: v45.36,43.94 49.63,39.67 58.17,39.67 69.44,28.4 69.44,16.2 v70.05,15.6 | v40.64,15.75 43.23,15.75 44.15,16.66 47.35,16.66 51.31,12.7 v53.44,12.7
HIGHBEAM  (via drill 0.35)
  Top 0.152: v49.78,11.02 50.09,11.33 51.92,11.33 R23.1 | v23.27,13.77 21.9,13.77 v21.59,14.07 | v16.26,19.41 13.67,19.41 11.53,21.54 BIKE.15
  Bottom 0.152: v49.78,11.02 33.17,11.02 30.43,13.77 v23.27,13.77 | v16.26,19.41 v21.59,14.07
LEFT  (via drill 0.35)
  Top 0.152: v46.28,44.7 44.15,44.7 U1.30 | v53.59,42.11 53.59,41.81 54.05,41.35 54.05,35.86 48.11,29.92 48.11,26.26 45.97,24.13 43.84,24.13 v43.38,23.67 | v34.24,18.19 34.24,16.51 33.02,15.29 R25.1 | v29.82,22.61 20.68,22.61 17.63,19.56 17.63,15.75 19.3,14.07 19.61,14.07 22.2,11.48 22.96,11.48 R22.2
  Bottom 0.152: v46.28,44.7 51,44.7 v53.59,42.11 | v43.38,23.67 41.55,23.67 38.05,20.17 | 38.05,20.17 36.07,18.19 v34.24,18.19 | v29.82,22.61 35.61,22.61 38.05,20.17
LEFTTURN
  Top 0.152: BIKE.13 19,11.48 20.07,11.48 R22.1
LIGHT  (via drill 0.35)
  Top 0.152: v39.27,41.05 39.57,41.35 39.57,48.97 U1.37 | v38.51,29.16 38.51,28.7 38.2,28.4 38.2,23.83 39.12,22.91 R29.1 | v10.62,34.19 10.62,32.66 10.16,32.21 10.16,30.38 14.43,26.11 19,26.11 20.37,27.48 v30.43,27.48
  Bottom 0.152: v39.27,41.05 39.27,40.74 37.74,39.22 37.74,36.02 38.51,35.25 v38.51,29.16 33.93,29.16 32.26,27.48 v30.43,27.48 | v10.62,34.19 11.84,34.19 12.6,34.95 12.6,36.17 11.99,36.78 11.99,44.4 13.21,45.62 13.21,47.14 12.9,47.45 12.29,47.45 11.99,47.14 8.64,47.14 6.05,44.55 5.13,44.55 LIGHT.1
MISO  (via drill 0.35)
  Top 0.152: v33.17,36.32 32.26,37.24 32.26,39.06 U1.11 | v37.9,34.95 38.51,35.56 44.76,35.56 49.02,39.83 49.78,39.83 50.24,40.28 v50.24,41.5 | ISP.1 v77.06,22
  Bottom 0.152: v33.17,36.32 36.53,36.32 v37.9,34.95 | v50.24,41.5 68.83,41.5 77.06,33.27 v77.06,22
N$2  (via drill 0.35)
  Top 0.152: v55.27,48.67 57.86,46.08 57.86,45.77 R7.2 | v15.34,43.03 14.73,42.42 11.07,42.42 5.28,36.63 2.69,36.63 1.63,35.56 1.63,32.51 3.76,30.38 USB.2
  Bottom 0.152: v55.27,48.67 46.74,48.67 46.43,48.97 45.82,48.97 41.71,44.86 41.71,44.7 41.4,44.4 40.79,44.4 38.66,46.53 38.66,48.06 38.05,48.67 32.56,48.67 31.5,47.6 19.91,47.6 v15.34,43.03
N$3
  Top 0.152: USB.3 5.59,34.8 5.59,36.47 11.23,42.11 17.32,42.11 20.07,44.86 20.07,47.75 21.44,49.12 21.74,49.12 24.18,51.56 55.88,51.56 61.67,45.77 R5.2
N$4
  Top 0.152: U1.6 23.57,43.18 22.35,44.4 22.05,44.4 C5.1
N$5
  Top 0.152: LED.A 23.72,30.53 25.09,30.53 25.86,31.29 27.99,31.29 28.75,30.53 R11.2
N$6  (via drill 0.35)
  Top 0.152: 46.43,48.36 46.43,48.67 47.04,49.28 55.88,49.28 58.93,46.23 58.93,45.16 56.49,42.72 55.73,42.72 54.66,41.66 v54.66,38.76 | 46.43,48.36 46.43,47.75 46.58,47.6 47.96,47.6 48.57,48.21 49.17,48.21 D1.C | v51.77,35.86 50.85,35.86 49.48,34.49 | 49.48,34.49 49.33,34.34 MIC5219.3 49.48,34.49 | 49.48,34.49 48.87,35.1 47.8,35.1 47.35,34.65 47.35,34.34 MIC5219.1 | v19.46,45.16 19,45.62 17.93,45.62 C3.+ | v21.29,43.33 22.96,43.33 23.72,42.57 v30.89,42.57 | 46.43,48.36 v46.13,48.36
  Bottom 0.152: v51.77,35.86 v54.66,38.76 | v21.29,43.33 v19.46,45.16 | v30.89,42.57 34.54,42.57 36.98,45.01 37.59,45.01 38.35,44.25 38.35,43.94 40.64,41.66 41.55,41.66 42.47,42.57 42.47,44.7 v46.13,48.36
N$7
  Top 0.152: R6.2 52.98,44.4 52.98,41.81 53.29,41.5 53.44,41.5 53.75,41.2 53.75,36.47 42.62,25.35 39.42,25.35 38.81,25.96 38.81,27.03 U2.1
N$8
  Top 0.152: R4.2 52.83,40.59 49.94,37.69 48.72,37.69 47.96,36.93 47.96,36.17 47.8,36.02 46.74,36.02 43.69,32.97 43.69,31.29 40.03,27.63 40.03,27.18 U2.2
N$9
  Top 0.152: BATTBAK.2 81.18,9.65 80.57,9.65 73.1,17.12 67.62,17.12 66.7,18.03 66.7,18.49 IC1.14
N$10  (via drill 0.35)
  Top 0.152: v47.04,38.76 47.19,38.76 49.02,40.59 R8.2 | v47.04,35.41 43.99,32.36 43.99,30.38 41.4,27.79 41.4,27.18 U2.3
  Bottom 0.152: v47.04,35.41 v47.04,38.76
N$11  (via drill 0.35)
  Top 0.152: 26.62,20.78 26.62,19.1 R10.1 | v27.84,22 26.62,20.78 | v34.7,21.08 43.54,21.08 45.52,19.1 R9.1 | BIKE.6 9.7,8.89 11.07,10.26 11.99,10.26 v15.04,13.31 | v18.24,16.51 18.24,18.49 17.93,18.8 17.93,19.41 20.83,22.3 25.09,22.3 26.62,20.78
  Bottom 0.152: v27.84,22 33.78,22 v34.7,21.08 | v18.24,16.51 v15.04,13.31
N$12  (via drill 0.35)
  Top 0.152: v37.9,18.64 37.59,18.95 35.76,18.95 R20.2 | v53.29,15.6 53.29,14.53 53.9,13.92 58.17,13.92 v63.19,8.89
  Bottom 0.152: v37.9,18.64 50.24,18.64 v53.29,15.6 | v63.19,8.89 69.44,2.64 75.08,2.64 76.15,3.71 LM317.OUT
N$13
  Top 0.152: R14.1 51.92,18.95 49.94,16.97 49.94,14.68 49.33,14.07 47.5,14.07 46.89,13.46 45.52,13.46 43.54,11.48 42.16,11.48 R12.2 42.01,11.33 40.03,9.35 28.3,9.35 27.99,9.65 27.99,12.09 26.62,13.46 26.62,15.14 R13.1
N$14
  Top 0.152: 77.83,27.94 77.83,30.68 75.84,32.66 75.84,33.58 POWER.2 | 77.83,27.94 71.73,27.94 66.85,23.06 55.12,23.06 54.81,23.37 54.81,28.09 55.88,29.16 L1.1 | 77.83,27.94 D2.C
N$15
  Top 0.152: R20.1 33.02,19.1 33.63,19.1 35.31,20.78 40.34,20.78 42.01,19.1 R19.2
N$16
  Top 0.152: R31.1 33.02,11.48 33.63,11.48 35.92,13.77 46.74,13.77 48.26,15.29 R33.2
NEUTRAL  (via drill 0.35)
  Top 0.152: v46.58,45.62 44.15,45.62 U1.31 | v74.32,5.84 68.53,5.84 65.33,2.64 31.5,2.64 26.62,7.52 R16.1 26.47,7.52 21.59,2.64 10.92,2.64 10.16,3.4 10.16,4.32 8.94,5.54 8.94,6.3 BIKE.4
  Bottom 0.152: v46.58,45.62 65.18,45.62 79.96,30.84 79.96,11.48 v74.32,5.84
OIL  (via drill 0.35)
  Top 0.152: v42.16,40.74 43.99,40.74 U1.25 | v51.16,13.77 49.94,13.77 48.87,12.7 46.89,12.7 45.67,11.48 R15.1 45.52,11.33 v44.3,10.11 | v42.62,8.43 v38.51,4.32
  Bottom 0.152: v42.16,40.74 41.25,40.74 39.73,39.22 38.66,39.22 38.35,38.91 38.35,37.85 48.41,27.79 49.94,27.79 52.22,25.5 52.22,23.98 55.27,20.93 55.27,18.34 54.05,17.12 54.05,16.2 54.2,16.05 54.2,14.38 52.98,13.16 51.77,13.16 v51.16,13.77 | v38.51,4.32 36.83,2.64 10.92,2.64 9.86,3.71 8.94,3.71 BIKE.2 | v44.3,10.11 v42.62,8.43
OPTION  (via drill 0.35)
  Top 0.152: U1.28 42.93,43.18 v41.1,45.01 | v20.98,51.41 15.49,51.41 10.01,45.92 4.83,45.92 1.32,42.42 1.32,30.68 2.54,29.46 4.98,29.46 | 4.98,29.46 6.81,31.29 6.81,33.27 8.79,35.25 8.79,35.56 OPTBTN.1 | v13.67,7.67 20.07,7.67 R27.1 | v6.2,12.39 6.2,28.24 4.98,29.46
  Bottom 0.152: v41.1,45.01 41.1,46.08 37.59,49.58 22.81,49.58 v20.98,51.41 | v13.67,7.67 10.92,7.67 10.16,8.43 10.16,9.35 9.25,10.26 8.33,10.26 v6.2,12.39
RESET  (via drill 0.35)
  Top 0.152: v21.9,46.99 21.9,48.21 R2.1 | v16.41,37.08 16.41,36.63 16.26,36.47 16.26,32.66 15.34,31.75 RESBTN.1 15.19,31.75 13.97,30.53 13.97,27.48 14.73,26.72 15.8,26.72 16.41,27.33 16.41,28.24 17.48,29.31 22.2,29.31 22.81,29.92 22.81,30.84 v24.03,32.05 | v34.85,35.56 34.85,37.24 U1.13 | v6.2,11.48 6.2,4.32 8.48,2.03 79.2,2.03 84.68,7.52 84.68,15.75 83.92,16.51 83.92,20.32 ISP.5
  Bottom 0.152: v21.9,46.99 21.9,40.59 18.39,37.08 v16.41,37.08 | v34.85,35.56 34.85,34.95 35.46,34.34 35.46,33.73 33.78,32.05 v24.03,32.05 | v6.2,11.48 5.59,12.09 5.59,21.23 15.19,30.84 15.19,31.75 RESBTN.1
RHT
  Top 0.152: 28.3,18.03 28.3,20.17 30.43,22.3 30.43,25.04 31.34,25.96 31.34,32.66 34.09,35.41 34.09,37.24 U1.12 | 28.3,18.03 29.82,16.51 30.12,16.51 30.43,16.2 30.43,12.55 29.36,11.48 R21.2 | 28.3,18.03 27.84,17.58 23.27,17.58 20.98,15.29 20.22,15.29 R24.1
RIGHTTURN
  Top 0.152: BIKE.11 12.75,16.51 19.61,9.65 24.79,9.65 26.47,11.33 R21.1
RPM  (via drill 0.35)
  Top 0.152: v39.42,39.83 40.49,39.83 41.4,38.91 41.4,37.39 U1.21 | v51.92,22.45 54.66,19.71 54.66,19.1 R14.2
  Bottom 0.152: v39.42,39.83 38.81,39.83 38.05,39.06 38.05,36.17 39.12,35.1 39.12,28.85 38.05,27.79 34.09,27.79 33.48,27.18 | 33.48,27.18 33.02,26.72 C11.1 33.48,27.18 | v51.92,22.45 49.17,25.2 35.46,25.2 33.48,27.18
SCL  (via drill 0.35)
  Top 0.152: v38.96,38.61 38.96,37.39 U1.18 | v43.38,33.73 43.38,32.82 42.93,32.36 42.16,32.36 41.4,33.12 41.4,33.73 U2.6 | v47.5,43.33 47.5,44.4 R1.1 | v70.05,16.51 67,16.51 65.94,17.58 65.94,19.86 65.79,20.02 65.02,20.02 64.26,19.25 | 64.26,19.25 64.26,18.64 IC1.16 64.26,19.25 | 64.26,19.25 v58.01,19.25
  Bottom 0.152: v38.96,38.61 38.96,38.15 v43.38,33.73 44.45,33.73 52.53,25.65 52.53,24.74 v58.01,19.25 | v47.5,43.33 50.85,39.98 58.32,39.98 70.05,28.24 v70.05,16.51
SDA  (via drill 0.35)
  Top 0.152: v47.5,46.99 R3.1 | v39.88,38.61 39.88,37.54 39.73,37.39 U1.19 | v61.06,17.12 64.41,17.12 65.33,18.03 65.33,18.49 IC1.15 | v43.38,34.65 42.62,33.88 U2.5
  Bottom 0.152: v47.5,46.99 47.04,46.99 42.77,42.72 42.77,40.44 41.55,39.22 40.49,39.22 v39.88,38.61 40.49,38 40.64,38 43.69,34.95 | v61.06,17.12 52.83,25.35 52.83,25.81 43.69,34.95 | 43.69,34.95 v43.38,34.65
SELECT  (via drill 0.35)
  Top 0.152: v31.19,48.21 32.11,47.3 U1.1 | v30.73,8.43 31.5,7.67 32.87,7.67 R28.1
  Bottom 0.152: v31.19,48.21 18.69,48.21 12.9,42.42 12.9,38.3 13.67,37.54 13.67,33.27 | 13.67,33.27 13.36,32.97 10.16,32.97 8.94,31.75 SELBTN.1 | v30.73,8.43 27.08,8.43 24.64,10.87 12.6,10.87 11.99,10.26 10.92,10.26 10.16,11.02 10.16,11.94 9.4,12.7 8.48,12.7 7.42,13.77 7.42,22.3 15.65,30.53 15.8,30.53 16.41,31.14 16.41,32.36 15.49,33.27 13.67,33.27
SPEED
  Top 0.152: 34.09,22 34.09,32.05 37.9,35.86 39.73,35.86 40.49,36.63 40.49,37.24 U1.20 | 34.09,22 32.41,20.32 30.58,20.32 29.36,19.1 R10.2 | 34.09,22 34.39,21.69 40.18,21.69 40.34,21.84 40.34,23.22 41.25,24.13 41.86,24.13 44.3,26.57 46.89,26.57 C10.1
SRX  (via drill 0.35)
  Top 0.152: v33.17,50.49 33.17,48.21 33.63,47.75 33.63,40.74 33.02,40.13 32.26,40.13 U1.10
  Bottom 0.152: v33.17,50.49 35.31,50.49 36.98,52.17 | 36.98,52.17 38.05,53.24 HM10.3 | 36.98,52.17 41.1,48.06 41.1,47.75 41.71,47.14 43.08,47.14 45.21,49.28 61.98,49.28 81.18,30.07 81.18,22.91 ISP.4
STX  (via drill 0.35)
  Top 0.152: v29.67,46.23 29.67,48.82 v31.8,50.95 | U1.9 32.11,40.89 v29.06,40.89 v21.29,40.89 | v13.82,39.67 10.16,36.02 10.16,35.1 7.11,32.05 7.11,3.86 8.64,2.34 65.48,2.34 68.22,5.08 80.87,5.08 84.38,8.58 84.38,15.6 81.33,18.64 81.33,20.32 ISP.3
  Bottom 0.152: v29.06,40.89 29.06,45.62 v29.67,46.23 | v31.8,50.95 32.72,50.95 35,53.24 35.46,53.24 HM10.4 | v13.82,39.67 20.07,39.67 v21.29,40.89
UVCC  (via drill 0.35)
  Top 0.152: 72.49,35.86 65.94,29.31 L1.2 | 72.49,35.86 72.64,36.02 75.39,36.02 76.61,34.8 76.61,32.36 76.76,32.21 78.13,32.21 79.05,33.12 79.05,33.58 POWER.4 | 57.25,51.87 57.25,51.71 70.66,38.3 70.66,37.69 72.49,35.86 | 57.25,51.87 57.25,53.24 C13.+ | v13.06,33.58 15.04,35.56 F1.1 | 33.02,46.23 33.33,45.92 33.33,42.88 32.87,42.42 32.26,42.42 U1.7 | 33.02,46.23 32.26,46.23 U1.2 | 33.02,46.23 33.02,46.53 33.33,46.84 33.33,47.45 v31.8,48.97 | 57.25,51.87 25.86,51.87 v25.55,52.17
  Bottom 0.152: USB.1 3.91,27.94 5.59,29.62 5.59,30.23 8.64,33.27 11.84,33.27 12.14,33.58 v13.06,33.58 13.06,34.49 13.21,34.65 13.21,37.54 12.6,38.15 12.6,43.18 15.95,46.53 15.95,48.36 | v31.8,48.97 22.5,48.97 20.37,51.11 | 20.37,51.11 20.37,51.71 21.9,53.24 24.03,53.24 5VOUT2.1 24.18,53.24 25.25,52.17 v25.55,52.17 | 5VOUT1.1 17.78,52.48 15.34,50.04 15.34,48.97 15.95,48.36 | 15.95,48.36 17.02,48.36 17.78,49.12 17.78,50.04 18.85,51.11 20.37,51.11
VCC  (via drill 0.35)
  Top 0.152: 50.39,12.55 51,13.16 52.98,13.16 53.14,13.31 56.49,13.31 61.82,7.98 64.57,7.98 65.33,8.74 65.33,9.35 IC1.2 65.48,9.5 65.48,9.96 66.85,11.33 v73.41,11.33 | 50.39,12.55 49.33,11.48 48.41,11.48 R15.2 | U1.44 34.24,49.12 34.24,49.89 34.85,50.49 41.25,50.49 42.01,49.73 42.01,49.12 U1.34 42.16,48.97 42.32,48.82 v42.93,48.82 43.99,47.75 45.36,47.75 47.8,45.31 48.26,45.31 49.02,44.55 R1.2 | v35.76,35.71 35.76,37.24 U1.14 | v37.59,33.88 38.66,33.88 U2.8 38.81,33.88 38.81,34.49 39.57,35.25 45.52,35.25 47.19,36.93 MIC5219.5 47.35,36.93 51.16,40.74 R4.1 51.31,40.74 51.31,44.4 R6.1 | D1.A 47.35,48.36 48.11,48.36 48.72,48.97 50.85,48.97 52.83,46.99 R3.2 56.49,46.99 57.1,46.38 57.1,45.01 56.95,44.86 53.9,44.86 53.44,45.31 52.07,45.31 51.31,44.55 R6.1 | U1.24 44.15,40.13 44.76,40.13 45.21,40.59 47.35,40.59 R8.1 47.5,40.74 47.5,42.42 49.02,43.94 49.02,44.4 R1.2 | R1.2 49.17,44.55 51.16,44.55 R6.1 | v30.73,7.52 29.36,7.52 R16.2 | v31.34,11.48 31.34,11.94 33.48,14.07 33.78,14.07 34.54,14.83 34.54,16.2 36.22,17.88 47.04,17.88 | 47.04,17.88 47.19,17.88 48.26,18.95 R9.2 | 19.15,34.34 21.9,34.34 | 19.15,34.34 17.93,35.56 F1.2 | 21.9,34.34 22.81,35.25 22.81,39.98 22.96,40.13 24.33,40.13 24.64,39.83 24.64,38 27.08,35.56 27.08,34.34 C9.1 | 21.9,34.34 C8.1 | v19.15,32.51 19.15,34.34 | C6.1 27.08,48.36 23.72,48.36 R2.2 23.57,48.21 23.57,47.75 22.2,46.38 22.05,46.38 17.93,42.27 17.93,41.81 | 17.93,41.81 17.93,40.74 C7.+ | ATEMP.2 7.72,40.74 7.72,44.4 LIGHT.2 | 8.79,14.83 8.79,14.07 BIKE.10 8.79,14.83 | 8.79,14.83 7.72,15.9 v7.72,28.09 | 11.53,31.75 11.53,35.56 OPTBTN.2
  Top 0.152: 17.93,41.81 11.84,41.81 v10.77,40.74 | 11.53,31.75 11.53,29.46 14.58,26.42 15.95,26.42 17.48,27.94 J2.2 22.96,27.94 25.4,30.38 27.08,30.38 R11.1 27.23,30.38 27.99,29.62 29.36,29.62 v29.97,30.23 | 11.53,31.75 SELBTN.2 | v10.31,15.14 9.09,15.14 8.79,14.83 | v50.39,12.7 50.39,12.55 | 47.04,17.88 v47.04,16.05
  Bottom 0.152: 73.71,11.33 73.71,17.73 78.74,22.76 ISP.2 | 73.71,11.33 73.71,3.86 LM317.IN | 73.71,11.33 v73.41,11.33 | v42.93,48.82 43.08,48.97 43.08,53.24 HM10.1 | v37.59,33.88 36.83,34.65 | 36.83,34.65 v35.76,35.71 | v30.73,7.52 31.34,8.13 v31.34,11.48 15.65,11.48 11.99,15.14 v10.31,15.14 | v19.15,32.51 19.15,29.31 J2.2 | v7.72,28.09 11.38,31.75 SELBTN.2 | OPTBTN.2 11.38,35.56 7.72,39.22 7.72,40.59 ATEMP.2 7.72,40.74 v10.77,40.74 | 36.83,34.65 32.41,30.23 v29.97,30.23 | v47.04,16.05 v50.39,12.7
WATER  (via drill 0.35)
  Top 0.152: v38.05,47.75 38.05,48.97 U1.39 | BIKE.12 8.94,16.51 10.16,17.73 10.16,22 10.92,22.76 16.1,22.76 19.76,26.42 v20.22,26.42 v29.36,26.42 | v31.04,24.74 32.87,22.91 R17.1
  Bottom 0.152: v38.05,47.75 35.92,47.75 35.31,48.36 32.72,48.36 31.19,46.84 29.36,46.84 20.22,37.69 v20.22,26.42 | v29.36,26.42 v31.04,24.74
X1  (via drill 0.35)
  Top 0.152: v22.5,32.66 22.81,32.97 22.81,34.8 23.57,35.56 23.57,39.37 C2.2 | v34.85,34.04 35.46,34.04 38.05,36.63 38.05,37.24 U1.17 | v47.35,24.59 47.35,24.89 48.41,25.96 48.41,29.77 56.49,37.85 56.49,39.52 16MHZ.1
  Bottom 0.152: 23.42,32.66 24.18,32.66 24.49,32.97 33.78,32.97 v34.85,34.04 | 23.42,32.66 v22.5,32.66 | v47.35,24.59 32.11,24.59 25.25,31.44 23.72,31.44 23.42,31.75 23.42,32.66
X2  (via drill 0.35)
  Top 0.152: v29.97,43.79 29.36,44.4 28.91,44.4 C4.2 | v33.02,35.25 v29.97,38.3 | v33.93,34.34 34.24,34.34 34.85,34.95 35.92,34.95 37.29,36.32 37.29,37.24 U1.16 37.44,37.39 37.44,38 38.66,39.22 40.18,39.22 v40.79,38.61 | v54.05,34.49 56.79,37.24 56.79,37.85 60.15,41.2 60.15,41.66 16MHZ.3
  Bottom 0.152: v29.97,38.3 v29.97,43.79 | v33.93,34.34 v33.02,35.25 | v54.05,34.49 44.91,34.49 v40.79,38.61

### Text on the board
tNames: TFTDash v4.1
bNames: www.tftdashproject.co.uk